# Altium schematic sheet Storage.SchDoc
size A4; SheetNumber: 7; SheetTotal: 7
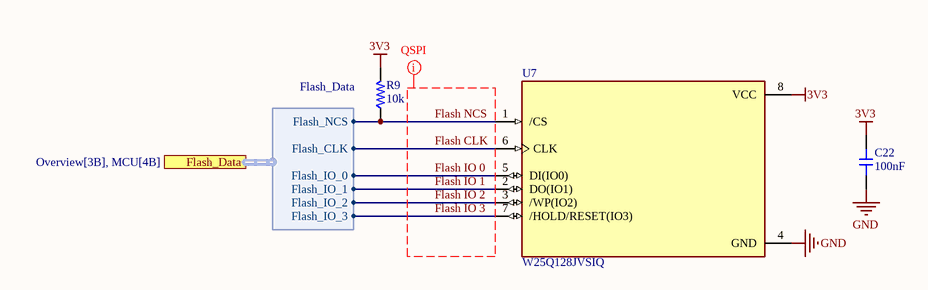
[diagram p0: Storage.SchDoc]

## Parts
C22  value 100nF  [CAP-0402]  (hidden comment: CL05B104KO5NNNC)
R9  value 10k  [RES-0402]  (hidden comment: 0402WGF1002TCE)
U7  W25Q128JVSIQ  [SOIC127P790X216-8N]

## Ports
Flash_Data (harness Flash_Data, see Overview[3B], MCU[4B])

## Harnesses
Flash_Data: Flash_NCS, Flash_CLK, Flash_IO_0, Flash_IO_1, Flash_IO_2, Flash_IO_3

## Nets
3V3: C22.2 R9.2 U7.8(VCC)
GND: C22.1 U7.4(GND)
Flash CLK: U7.6(CLK) ; port Flash_Data.Flash_CLK
Flash IO 0: U7.5(DI(IO0)) ; port Flash_Data.Flash_IO_0
Flash IO 1: U7.2(DO(IO1)) ; port Flash_Data.Flash_IO_1
Flash IO 2: U7.3(/WP(IO2)) ; port Flash_Data.Flash_IO_2
Flash IO 3: U7.7(/HOLD/RESET(IO3)) ; port Flash_Data.Flash_IO_3
Flash NCS: R9.1 U7.1(/CS) ; port Flash_Data.Flash_NCS

## Layout directives
net class QSPI: Flash CLK, Flash IO 0, Flash IO 1, Flash IO 2, Flash IO 3, Flash NCS

## Library data of the parts
C22 = CMP-001-00142-1: Capacitor, Ceramic (MLCC), 100nF, ±10%, 16V, X7R, ±10%, SMD 0402; Manufacturer: Samsung Electro-Mechanics; Design Item ID: CL05B104KO5NNNC; Source: jlcpcb_capacitors_basic.schlib; ComponentLink2URL: https://jlcpcb.com/partdetail/C1525; Voltage Rating: 16V; Tolerance: 10%; Temperature Coefficient: X7R; ComponentLink2Description: JLCPCB Part URL; ComponentLink1URL: https://datasheet.lcsc.com/lcsc/1810191219_Samsung-Electro-Mechanics-CL05B104KO5NNNC_C1525.pdf; JLCPCB Basic Part: Yes; JLCPCB Part Number: C1525; ComponentLink3URL: https://lcsc.com/product-detail/Multilayer-Ceramic-Capacitors-MLCC---SMD-SMT_Samsung-Electro-Mechanics-Samsung-Electro-Mechanics-CL05B104KO5NNNC_C1525.html; Manufacturer Part Number: CL05B104KO5NNNC; ComponentLink1Description: Datasheet; Case/Package: 0402; RoHS: Yes; Category: Capacitors - MLCC; ComponentLink3Description: LCSC Part URL
R9 = CMP-009-00191-1: Resistor, 10kΩ, ±1%, 62.5mW, 50V, ±100ppm/℃, -55℃~+155℃, SMD 0402; Manufacturer: Uniroyal; Temperature Rating: -55℃~+155℃; ComponentLink1URL: https://datasheet.lcsc.com/lcsc/2206010100_UNI-ROYAL-Uniroyal-Elec-0402WGF1002TCE_C25744.pdf; Source: jlcpcb_resistors_basic.schlib; Tolerance: 1%; Design Item ID: 0402WGF1002TCE; ComponentLink1Description: Datasheet; ComponentLink2URL: https://jlcpcb.com/partdetail/C25744; Category: Resistors; JLCPCB Part Number: C25744; ComponentLink2Description: JLCPCB Part URL; Temperature Coefficient: ±100ppm/℃; JLCPCB Basic Part: Yes; Power Rating: 62.5mW; Case/Package: 0402; Voltage Rating: 50V; Manufacturer Part Number: 0402WGF1002TCE
U7 = CMP-040-000000-2: FLASH - NOR Memory IC 128Mb (16M x 8) SPI - Quad I/O, QPI, DTR 133 MHz 8-SOIC; MF: Winbond Electronics; Capacity: 128Mb; Design Item ID: W25Q128JVSIQ; Pin Count: 8; MP: W25Q128JVSIQ; Price: None; Package: SOIC-8 Winbond; LCSC Part #: C97521; JLCPCB Part Number: C97521